# EAGLE schematic Sender Ph1 (EAGLE 9.6.2)

## Sheet 1 of 6: Processor & Base Design
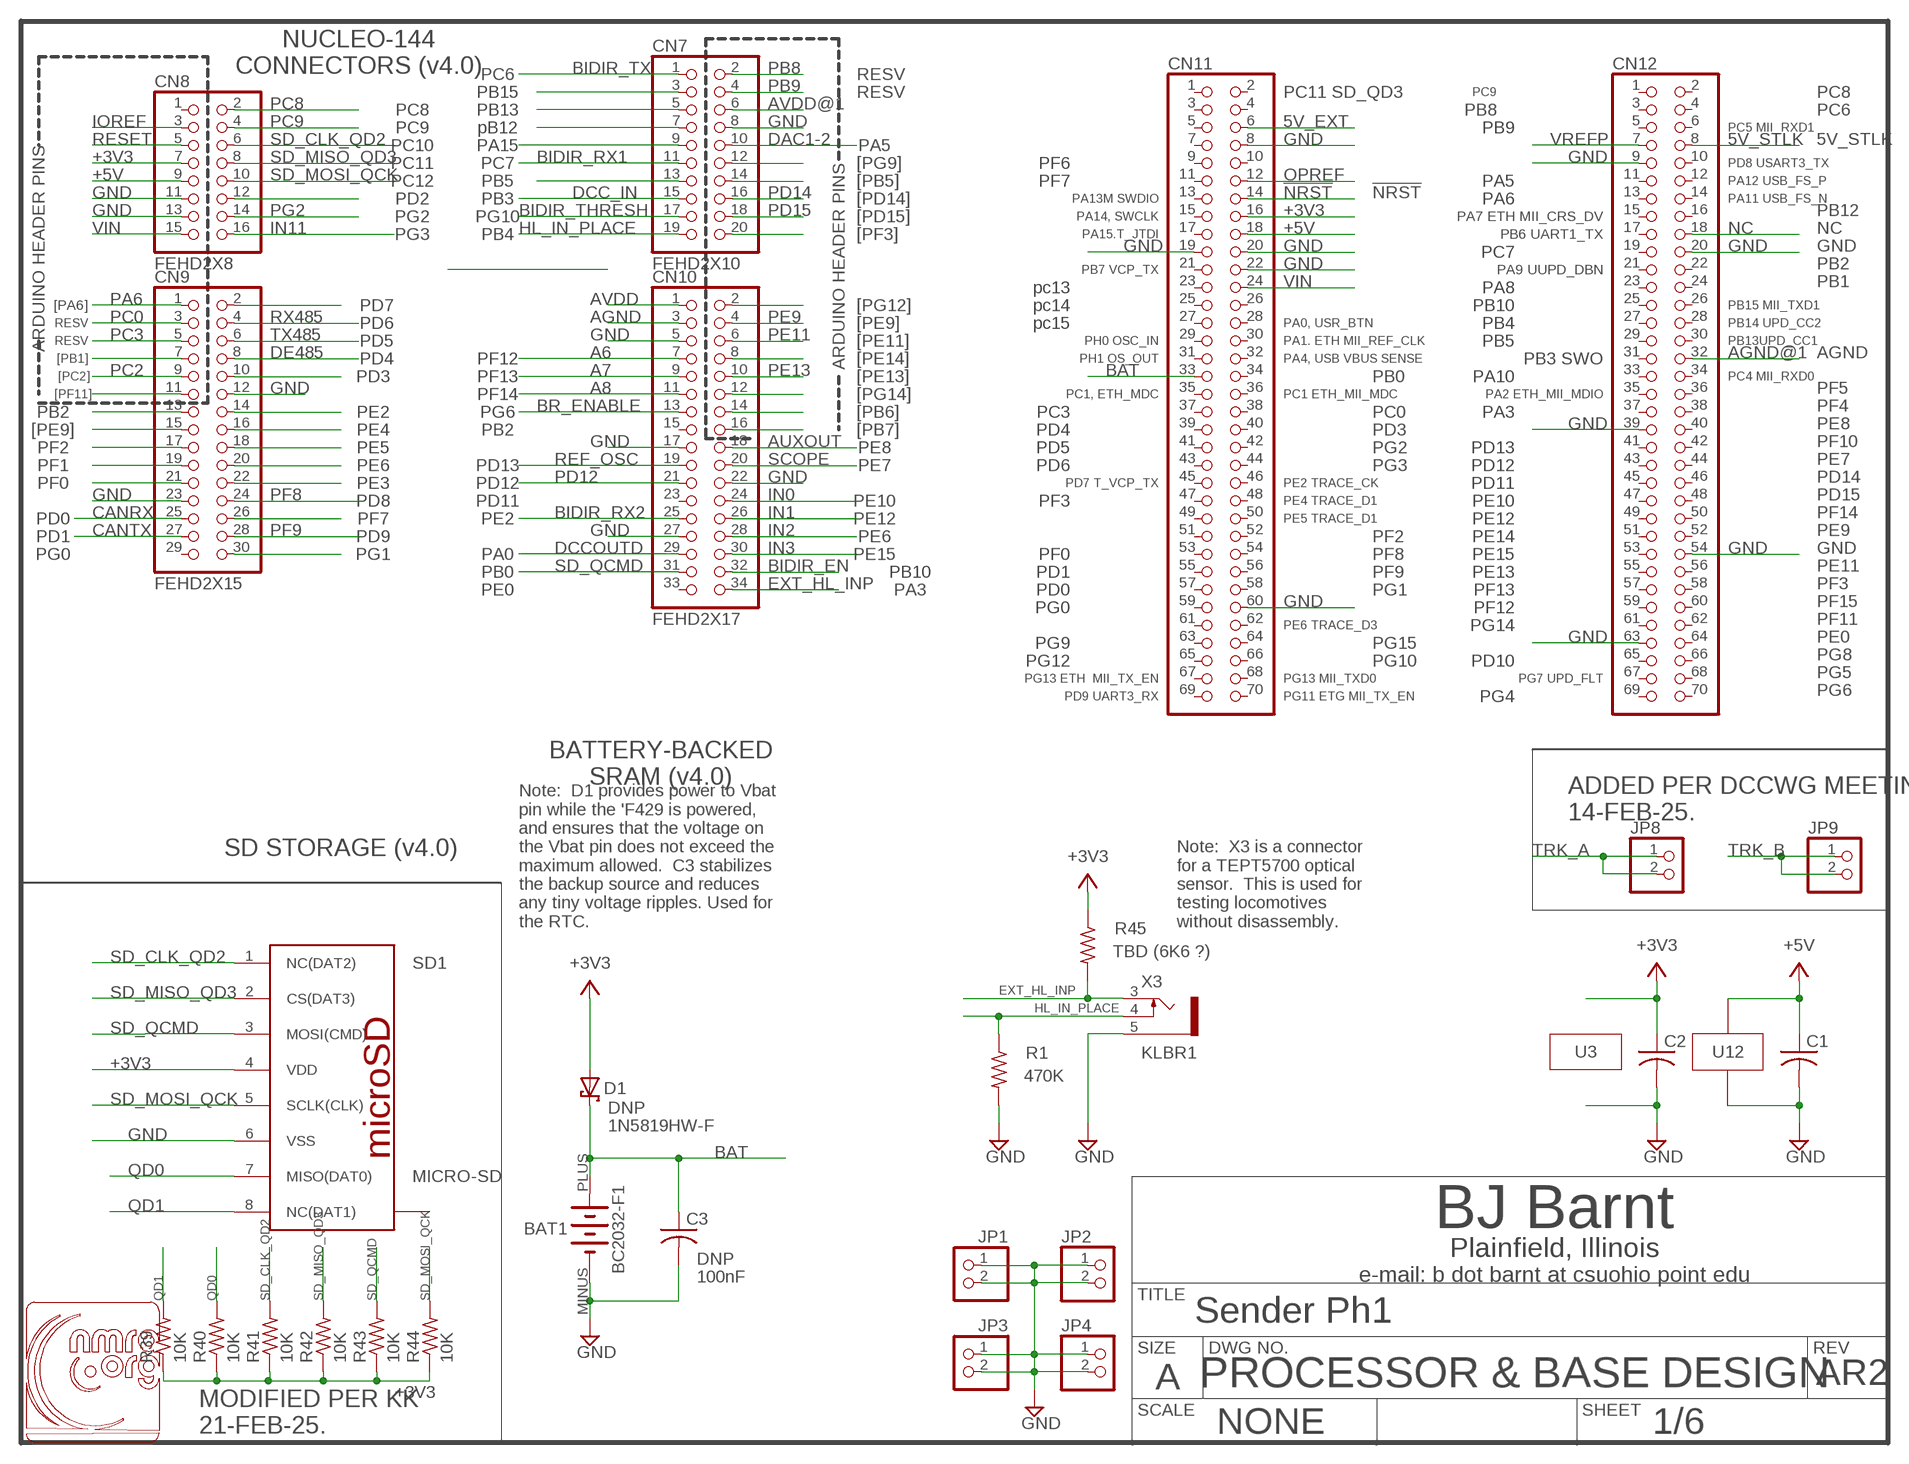
[diagram p0: schematic, sheet 1]
BORDER1 (ANSI_A_SHT2): SPICEPREFIX: X

### Parts
BAT1  BC2032-F1  [BC2032-F1]
C1  C-USC0805  [C0805]
C2  C-USC0805  [C0805]
C3  DNP  C-USC0805  [C0805]
CN7  FEHD2X10  [FE-10X2]
CN8  FEHD2X8  [FE-08X2]
CN9  FEHD2X15  [FE-15X2]
CN10  FEHD2X17  [FE-17X2]
CN11  PINHD-2X35  [2X35]
CN12  PINHD-2X35  [2X35]
D1  DNP  1N5819HW-F  [SOD123]
JP1  PINHD-1X2  [1X02]
JP2  PINHD-1X2  [1X02]
JP3  PINHD-1X2  [1X02]
JP4  PINHD-1X2  [1X02]
JP8  PINHD-1X2  [1X02]
JP9  PINHD-1X2  [1X02]
R1  470K  R-US_R0805  [R0805]
R39  10K  R-US_R0805  [R0805]
R40  10K  R-US_R0805  [R0805]
R41  10K  R-US_R0805  [R0805]
R42  10K  R-US_R0805  [R0805]
R43  10K  R-US_R0805  [R0805]
R44  10K  R-US_R0805  [R0805]
R45  TBD (6K6 ?)  R-US_R0805  [R0805]
SD1  MICRO-SD  [HINGED-SD]
U12  AM26LV31D  AM26C31CD  [SO16]
U$2  NMRA_LOGO-SMALL  [NMRA_LOGO_SM]
X3  KLBR1  [KLBR1]

### Nets
5V_EXT: CN11.6
5V_STLK: CN12.8
!NRST: CN11.14
+3V3: C2.1 CN8.7 CN11.16 D1.2(A) R39.1 R40.1 R41.1 R42.1 R43.1 R44.1 R45.1 SD1.4(VDD) ; also sheet 2,3,4,5
+5V: C1.1 CN8.9 CN11.18 U12.16(VCC) ; also sheet 6
A6: CN10.7 ; also sheet 3
A7: CN10.9 ; also sheet 3
A8: CN10.11 ; also sheet 2
AGND: CN10.3
AGND@1: CN12.32
AUXOUT: CN10.18 ; also sheet 6
AVDD: CN10.1
AVDD@1: CN7.6
BAT: BAT1.PLUS(+) C3.1 CN11.33 D1.1(C)
BIDIR_EN: CN10.32 ; also sheet 4
BIDIR_RX1: CN7.11 ; also sheet 5
BIDIR_RX2: CN10.25 ; also sheet 5
BIDIR_THRESH: CN7.17 ; also sheet 5
BIDIR_TX: CN7.1
BR_ENABLE: CN10.13 ; also sheet 4
CANRX: CN9.25 ; also sheet 2
CANTX: CN9.27 ; also sheet 2
DAC1-2: CN7.10
DCC_IN: CN7.15 ; also sheet 4
DCCOUTD: CN10.29 ; also sheet 4,6
DE485: CN9.8 ; also sheet 2
EXT_HL_INP: CN10.34 R45.2 X3.3
GND: BAT1.MINUS(-) C1.2 C2.2 C3.2 CN7.8 CN8.11 CN8.13 CN9.12 CN9.23 CN10.5 CN10.17 CN10.22 CN10.27 CN11.8 CN11.19 CN11.20 CN11.22 CN11.60 CN12.9 CN12.20 CN12.39 CN12.54 CN12.63 JP1.1 JP1.2 JP2.1 JP2.2 JP3.1 JP3.2 JP4.1 JP4.2 R1.2 SD1.6(VSS) U12.8(GND) X3.5 ; also sheet 2,3,4,5,6
HL_IN_PLACE: CN7.19 R1.1 X3.4
IN0: CN10.24 ; also sheet 6
IN1: CN10.26 ; also sheet 6
IN2: CN10.28 ; also sheet 6
IN3: CN10.30 ; also sheet 6
IN11: CN8.16
IOREF: CN8.3
N$3: CN9.7
N$11: CN9.11
N$18: CN9.15
N$19: CN9.13
N$24: CN9.17
N$32: CN9.19
N$33: CN9.21
N$34: CN9.10
N$35: CN9.14
N$36: CN9.16
N$37: CN9.18
N$38: CN9.20
N$39: CN9.22
N$40: CN9.26
N$41: CN9.30
N$42: CN9.2
N$43: CN8.12
N$47: CN7.3
N$48: CN7.5
N$49: CN7.7
N$50: CN7.9
N$51: CN7.13
N$52: CN7.12
N$53: CN7.14
N$54: CN7.20
N$55: CN10.2
N$56: CN10.8
N$57: CN10.12
N$58: CN10.14
N$59: CN10.16
NC: CN12.18
OPREF: CN11.12
PA6: CN9.1
PB8: CN7.2
PB9: CN7.4
PC0: CN9.3
PC2: CN9.9
PC3: CN9.5
PC8: CN8.2
PC9: CN8.4
PD12: CN10.21
PD14: CN7.16
PD15: CN7.18
PE9: CN10.4
PE11: CN10.6
PE13: CN10.10
PF8: CN9.24
PF9: CN9.28
PG2: CN8.14
QD0: R40.2 SD1.7(MISO(DAT0))
QD1: R39.2 SD1.8(NC(DAT1))
REF_OSC: CN10.19 ; also sheet 3
RESET: CN8.5
RX485: CN9.4 ; also sheet 2
SCOPE: CN10.20 ; also sheet 6
SD_CLK_QD2: CN8.6 R41.2 SD1.1(NC(DAT2))
SD_MISO_QD3: CN8.8 R42.2 SD1.2(CS(DAT3))
SD_MOSI_QCK: CN8.10 R44.2 SD1.5(SCLK(CLK))
SD_QCMD: CN10.31 R43.2 SD1.3(MOSI(CMD))
TRK_A: JP8.1 JP8.2 ; also sheet 4,5
TRK_B: JP9.1 JP9.2 ; also sheet 4,5
TX485: CN9.6 ; also sheet 2
VIN: CN8.15 CN11.24
VREFP: CN12.7
Unconnected: CN8.1 CN9.29 CN10.15 CN10.23 CN10.33 CN11.1 CN11.2 CN11.3 CN11.4 CN11.5 CN11.7 CN11.9 CN11.10 CN11.11 CN11.13 CN11.15 CN11.17 CN11.21 CN11.23 CN11.25 CN11.26 CN11.27 CN11.28 CN11.29 CN11.30 CN11.31 CN11.32 CN11.34 CN11.35 CN11.36 CN11.37 CN11.38 CN11.39 CN11.40 CN11.41 CN11.42 CN11.43 CN11.44 CN11.45 CN11.46 CN11.47 CN11.48 CN11.49 CN11.50 CN11.51 CN11.52 CN11.53 CN11.54 CN11.55 CN11.56 CN11.57 CN11.58 CN11.59 CN11.61 CN11.62 CN11.63 CN11.64 CN11.65 CN11.66 CN11.67 CN11.68 CN11.69 CN11.70 CN12.1 CN12.2 CN12.3 CN12.4 CN12.5 CN12.6 CN12.10 CN12.11 CN12.12 CN12.13 CN12.14 CN12.15 CN12.16 CN12.17 CN12.19 CN12.21 CN12.22 CN12.23 CN12.24 CN12.25 CN12.26 CN12.27 CN12.28 CN12.29 CN12.30 CN12.31 CN12.33 CN12.34 CN12.35 CN12.36 CN12.37 CN12.38 CN12.40 CN12.41 CN12.42 CN12.43 CN12.44 CN12.45 CN12.46 CN12.47 CN12.48 CN12.49 CN12.50 CN12.51 CN12.52 CN12.53 CN12.55 CN12.56 CN12.57 CN12.58 CN12.59 CN12.60 CN12.61 CN12.62 CN12.64 CN12.65 CN12.66 CN12.67 CN12.68 CN12.69 CN12.70 SD1.G1 SD1.G2 SD1.G3 SD1.G4

### Notes on the sheet
- XXX
- XXX
- NUCLEO-144
  CONNECTORS (v4.0)
- PC6 | RESV
- PB15 | RESV | PC11 SD_QD3 | PC9 | PC8
- PC8 | PB13 | PB8 | PC6
- PC9 | pB12 | PB9 | PC5 MII_RXD1
- PC10 | PA15 | PA5
- PC11 | PC7 | [PG9] | PF6 | PD8 USART3_TX
- PC12 | PB5 | [PB5] | PF7 | PA5 | PA12 USB_FS_P
- PD2 | XXX | PB3 | [PD14] | PA13M SWDIO | PA6 | PA11 USB_FS_N
- PG2 | PG10 | [PD15] | PA14, SWCLK | PA7 ETH MII_CRS_DV
- PG3 | PB4 | [PF3] | PA15.T_JTDI | PB6 UART1_TX
- ARDUINO HEADER PINS | PC7
- ARDUINO HEADER PINS
- PB7 VCP_TX | PA9 UUPD_DBN
- pc13 | PA8
- [PA6] | PD7 | [PG12] | pc14 | PB10 | PB15 MII_TXD1
- RESV | PD6 | [PE9] | pc15 | PA0, USR_BTN | PB4 | PB14 UPD_CC2
- RESV | PD5 | [PE11] | PH0 OSC_IN | PA1. ETH MII_REF_CLK | PB5 | PB13UPD_CC1
- [PB1] | PD4 | PF12 | [PE14] | PH1 OS_OUT | PA4, USB VBUS SENSE | PB3 SWO
- [PC2] | PD3 | PF13 | [PE13] | PB0 | PA10 | PC4 MII_RXD0
- [PF11] | PF14 | [PG14] | PC1, ETH_MDC | PC1 ETH_MII_MDC | PA2 ETH_MII_MDIO
- PB2 | PE2 | XXX | PG6 | [PB6] | PC3 | PC0 | PA3
- [PE9] | PE4 | PB2 | [PB7] | PD4 | PD3
- PF2 | PE5 | PE8 | PD5 | PG2 | PD13
- PF1 | PE6 | XXX | PD13 | PE7 | PD6 | PG3 | PD12
- PF0 | PE3 | XXX | PD12 | PD7 T_VCP_TX | PE2 TRACE_CK | PD11
- PD8 | PD11 | PE10 | PF3 | PE4 TRACE_D1 | PE10
- PD0 | PF7 | PE2 | PE12 | PE5 TRACE_D1 | PE12
- PD1 | PD9 | PE6 | PF2 | PE14
- PG0 | PG1 | PA0 | PE15 | PF0 | PF8 | PE15
- PB0 | PB10 | PD1 | PF9 | PE13
- XXX | PE0 | PA3 | PD0 | PG1 | PF13
- PG0 | PF12
- PE6 TRACE_D3 | PG14
- PG9 | PG15
- PG12 | PG10 | PD10
- PG13 ETH  MII_TX_EN | PG13 MII_TXD0 | PG7 UPD_FLT
- PD9 UART3_RX | PG11 ETG MII_TX_EN | PG4
- BATTERY-BACKED
  SRAM (v4.0)
- ADDED PER DCCWG MEETING
  14-FEB-25.
- SD STORAGE (v4.0)
- Note:  D1 provides power to Vbat 
  pin while the 'F429 is powered, 
  and ensures that the voltage on 
  the Vbat pin does not exceed the 
  maximum allowed.  C3 stabilizes 
  the backup source and reduces 
  any tiny voltage ripples. Used for
  the RTC.
- Note:  X3 is a connector
  for a TEPT5700 optical 
  sensor.  This is used for
  testing locomotives 
  without disassembly.
- U3 | U12
- 1N5819HW-F
- 100nF
- PROCESSOR & BASE DESIGN | AR2
- MODIFIED PER KK
  21-FEB-25.

## Sheet 2 of 6: LCC & RS-485 Communications
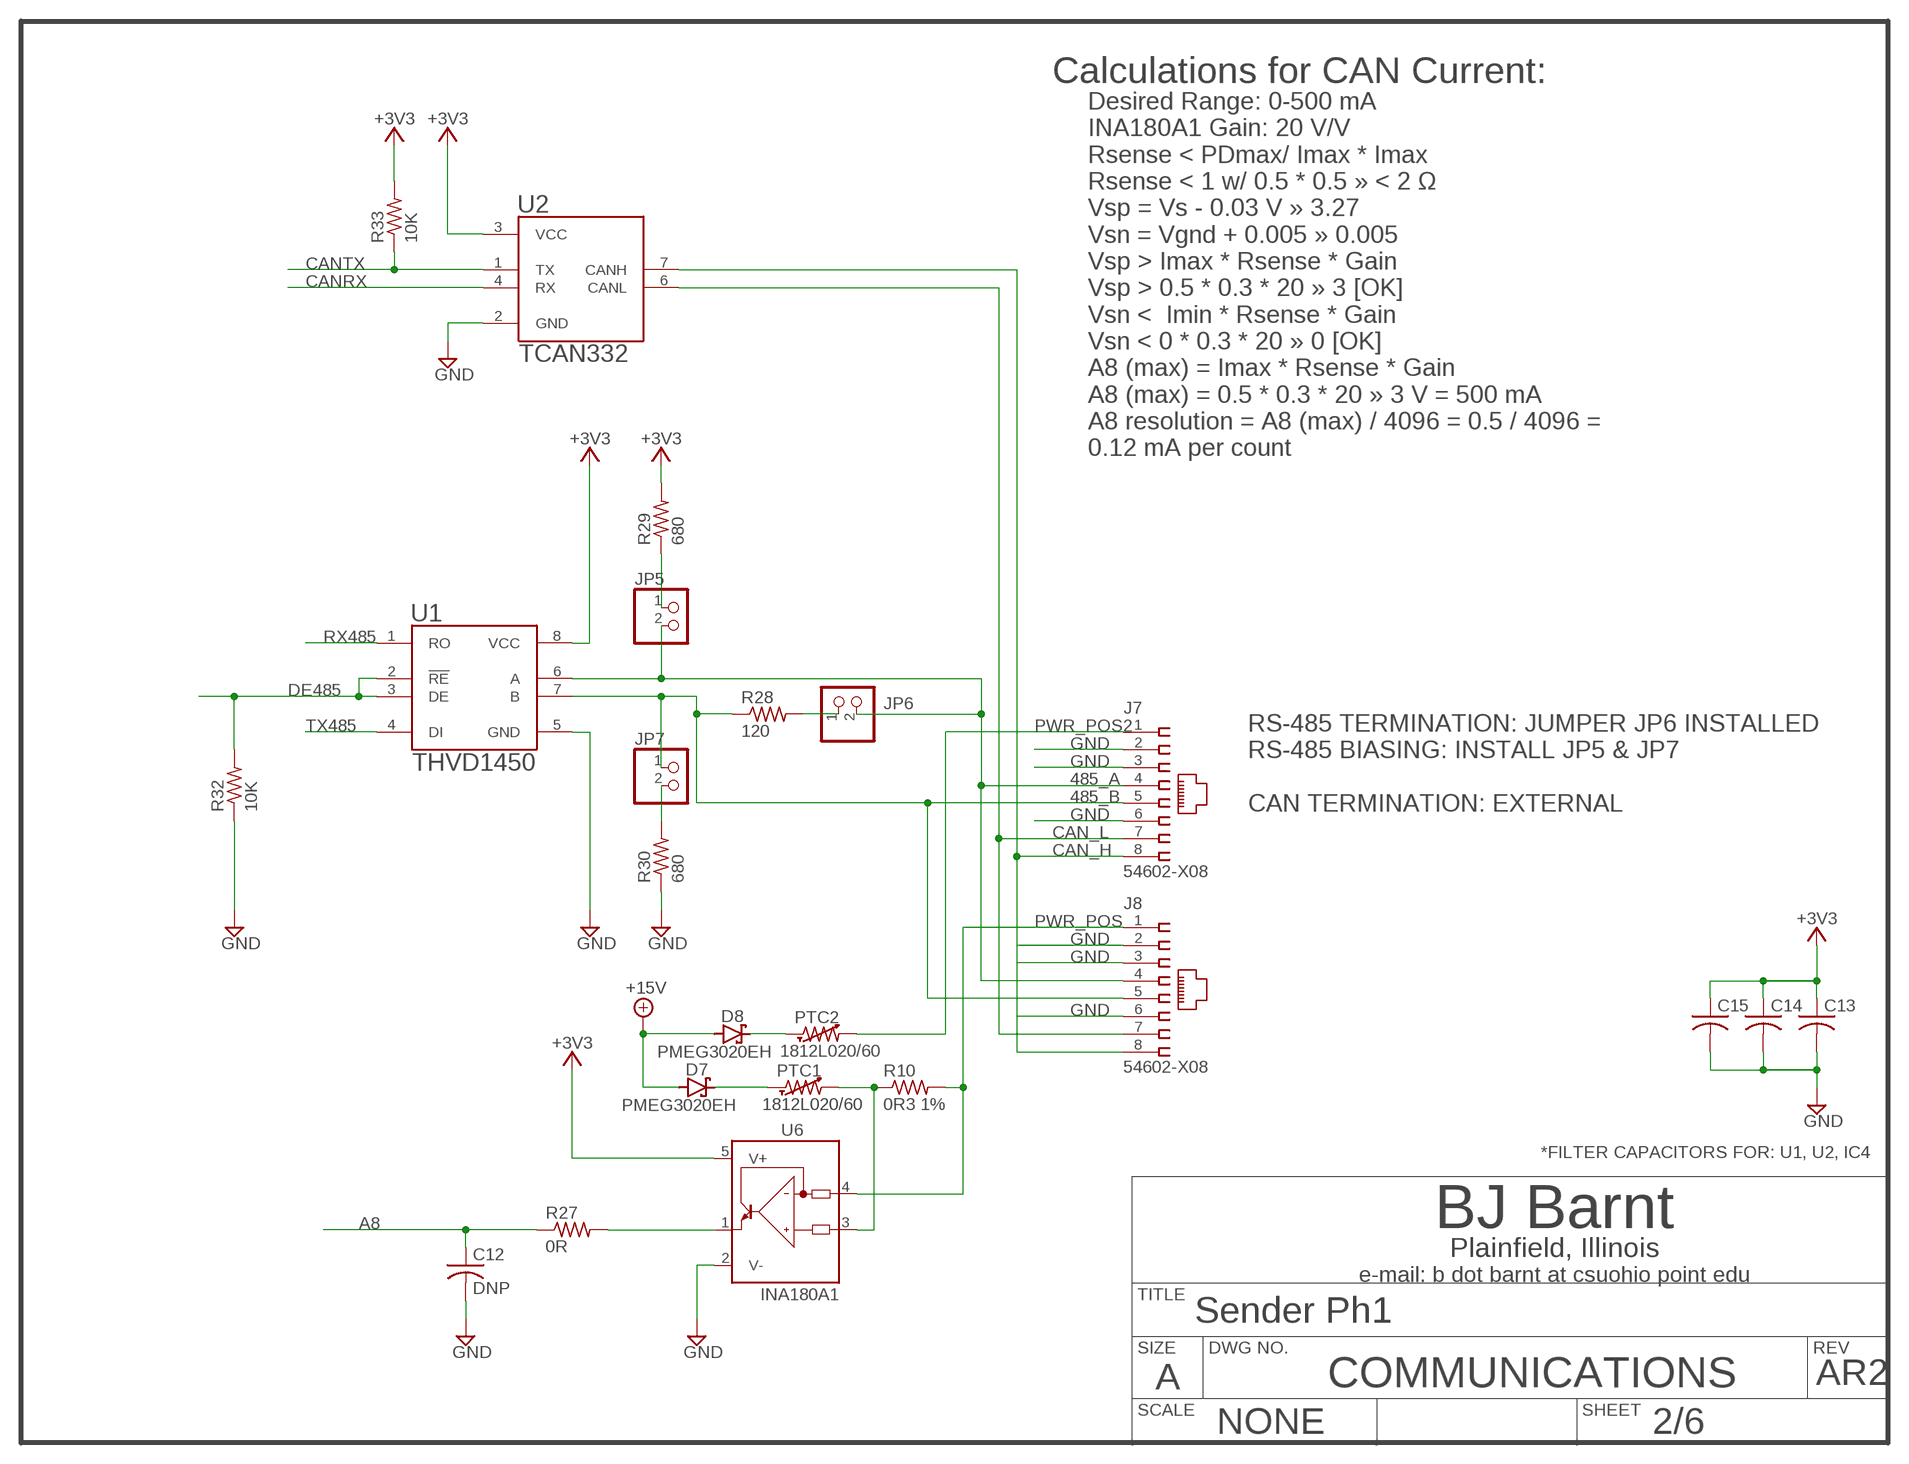
[diagram p1: schematic, sheet 2]
BORDER2 (ANSI_A_SHT2): SPICEPREFIX: X

### Parts
C12  DNP  C-USC0805  [C0805]
C13  C-USC0805  [C0805]
C14  C-USC0805  [C0805]
C15  C-USC0805  [C0805]
D7  PMEG3020EH  [SODFL3718X115]
D8  PMEG3020EH  [SODFL3718X115]
J7  54602-X08  [54602-X08]
J8  54602-X08  [54602-X08]
JP5  PINHD1X2  [FE-01X2]
JP6  PINHD1X2  [FE-01X2]
JP7  PINHD1X2  [FE-01X2]
PTC1  1812L020/60  [1812L]
PTC2  1812L020/60  [1812L]
R10  0R3 1%  R-US_R2512  [R2512]
R27  0R  R-US_R0805  [R0805]
R28  120  R-US_R1206  [R1206]
R29  680  R-US_R1206  [R1206]
R30  680  R-US_R1206  [R1206]
R32  10K  R-US_R0805  [R0805]
R33  10K  R-US_R0805  [R0805]
U1  THVD1450  SN65HVD11D  [SO-08]
U2  TCAN332  SN65HVD232QD  [SO-08]
U6  INA180A1  INA138  [SOT23-5]

### Nets
485_A: J7.4 J8.4 JP5.2 JP6.2 U1.6(A)
485_B: J7.5 J8.5 JP7.1 R28.1 U1.7(B)
+3V3: C13.1 C14.1 C15.1 R29.2 R33.2 U1.8(VCC) U2.3(VCC) U6.5(V+) ; also sheet 1,3,4,5
+15V: D7.2(A) D8.2(A) ; also sheet 3,4,5
A8: C12.1 R27.1 ; also sheet 1
CAN_H: J7.8 J8.8 U2.7(CANH)
CAN_L: J7.7 J8.7 U2.6(CANL)
CANRX: U2.4(RX) ; also sheet 1
CANTX: R33.1 U2.1(TX) ; also sheet 1
DE485: R32.2 U1.2(!RE) U1.3(DE) ; also sheet 1
GND: C12.2 C13.2 C14.2 C15.2 J7.2 J7.3 J7.6 J8.2 J8.3 J8.6 R30.1 R32.1 U1.5(GND) U2.2(GND) U6.2(V-) ; also sheet 1,3,4,5,6
N$4: PTC1.P$2 R10.1 U6.3(IN+)
N$17: R27.2 U6.1(OUT)
N$20: JP5.1 R29.1
N$21: JP7.2 R30.2
N$22: JP6.1 R28.2
N$26: D7.1(C) PTC1.P$1
N$27: D8.1(C) PTC2.P$1
PWR_POS: J8.1 R10.2 U6.4(IN-)
PWR_POS2: J7.1 PTC2.P$2
RX485: U1.1(RO) ; also sheet 1
TX485: U1.4(DI) ; also sheet 1

### Notes on the sheet
- Calculations for CAN Current:
- Desired Range: 0-500 mA
  INA180A1 Gain: 20 V/V
  Rsense < PDmax/ Imax * Imax
  Rsense < 1 w/ 0.5 * 0.5 » < 2 Ω
  Vsp = Vs - 0.03 V » 3.27
  Vsn = Vgnd + 0.005 » 0.005
  Vsp > Imax * Rsense * Gain
  Vsp > 0.5 * 0.3 * 20 » 3 [OK]
  Vsn <  Imin * Rsense * Gain
  Vsn < 0 * 0.3 * 20 » 0 [OK]
  A8 (max) = Imax * Rsense * Gain
  A8 (max) = 0.5 * 0.3 * 20 » 3 V = 500 mA
  A8 resolution = A8 (max) / 4096 = 0.5 / 4096 = 
  0.12 mA per count
- RS-485 TERMINATION: JUMPER JP6 INSTALLED
  RS-485 BIASING: INSTALL JP5 & JP7
  
  CAN TERMINATION: EXTERNAL
- *FILTER CAPACITORS FOR: U1, U2, IC4
- COMMUNICATIONS | AR2

## Sheet 3 of 6: Self-Test ardware
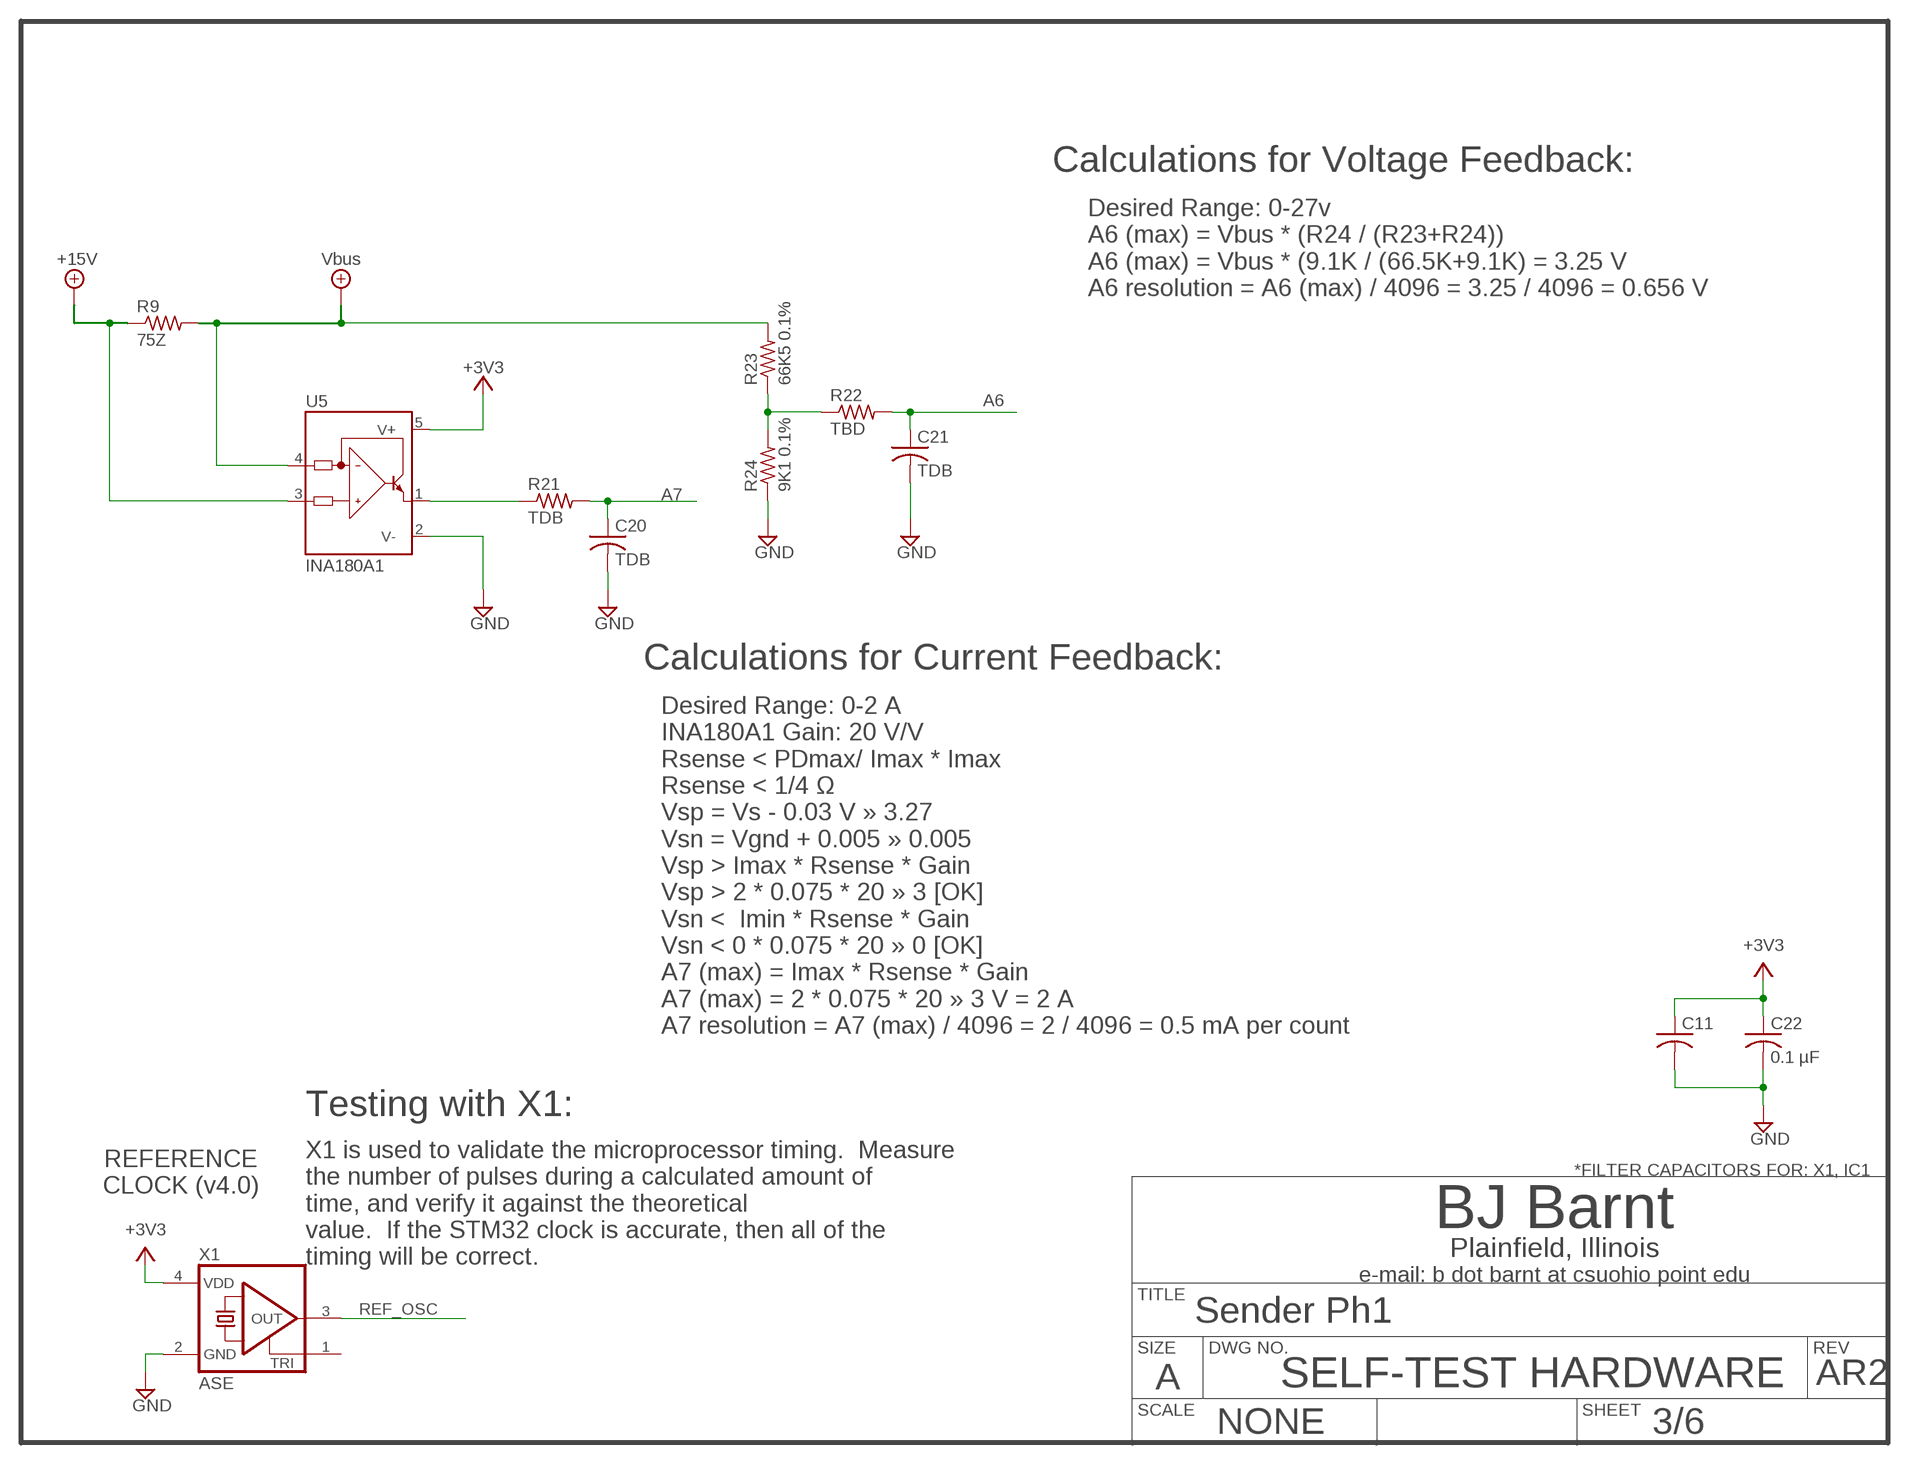
[diagram p2: schematic, sheet 3]
BORDER4 (ANSI_A_SHT2): SPICEPREFIX: X

### Parts
C11  C-USC0805  [C0805]
C20  TDB  C-USC0805  [C0805]
C21  TDB  C-USC0805  [C0805]
C22  0.1 µF  C-USC0805  [C0805]
R9  75Z  R-US_R5025  [R5025]
R21  TDB  R-US_R0805  [R0805]
R22  TBD  R-US_R0805  [R0805]
R23  66K5 0.1%  R-US_R0805  [R0805]
R24  9K1 0.1%  R-US_R0805  [R0805]
U5  INA180A1  INA138  [SOT23-5]
X1  ASE  [ASE]

### Nets
+3V3: C11.1 C22.1 U5.5(V+) X1.4(VDD) ; also sheet 1,2,4,5
+15V: R9.1 U5.3(IN+) ; also sheet 2,4,5
A6: C21.1 R22.2 ; also sheet 1
A7: C20.1 R21.2 ; also sheet 1
GND: C11.2 C20.2 C21.2 C22.2 R24.1 U5.2(V-) X1.2(GND) ; also sheet 1,2,4,5,6
N$12: R21.1 U5.1(OUT)
N$15: R22.1 R23.1 R24.2
REF_OSC: X1.3(OUT) ; also sheet 1
VBUS: R9.2 R23.2 U5.4(IN-) ; supply symbol labelled Vbus ; also sheet 4
Unconnected: X1.1(TRI)

### Notes on the sheet
- Calculations for Voltage Feedback:
- Desired Range: 0-27v
  A6 (max) = Vbus * (R24 / (R23+R24))
  A6 (max) = Vbus * (9.1K / (66.5K+9.1K) = 3.25 V
  A6 resolution = A6 (max) / 4096 = 3.25 / 4096 = 0.656 V
- Calculations for Current Feedback:
- Desired Range: 0-2 A
  INA180A1 Gain: 20 V/V
  Rsense < PDmax/ Imax * Imax
  Rsense < 1/4 Ω
  Vsp = Vs - 0.03 V » 3.27
  Vsn = Vgnd + 0.005 » 0.005
  Vsp > Imax * Rsense * Gain
  Vsp > 2 * 0.075 * 20 » 3 [OK]
  Vsn <  Imin * Rsense * Gain
  Vsn < 0 * 0.075 * 20 » 0 [OK]
  A7 (max) = Imax * Rsense * Gain
  A7 (max) = 2 * 0.075 * 20 » 3 V = 2 A
  A7 resolution = A7 (max) / 4096 = 2 / 4096 = 0.5 mA per count
- Testing with X1:
- X1 is used to validate the microprocessor timing.  Measure 
  the number of pulses during a calculated amount of 
  time, and verify it against the theoretical
  value.  If the STM32 clock is accurate, then all of the 
  timing will be correct.
- *FILTER CAPACITORS FOR: X1, IC1
- REFERENCE
  CLOCK (v4.0)
- SELF-TEST HARDWARE | AR2

## Sheet 4 of 6: Power & Power Station
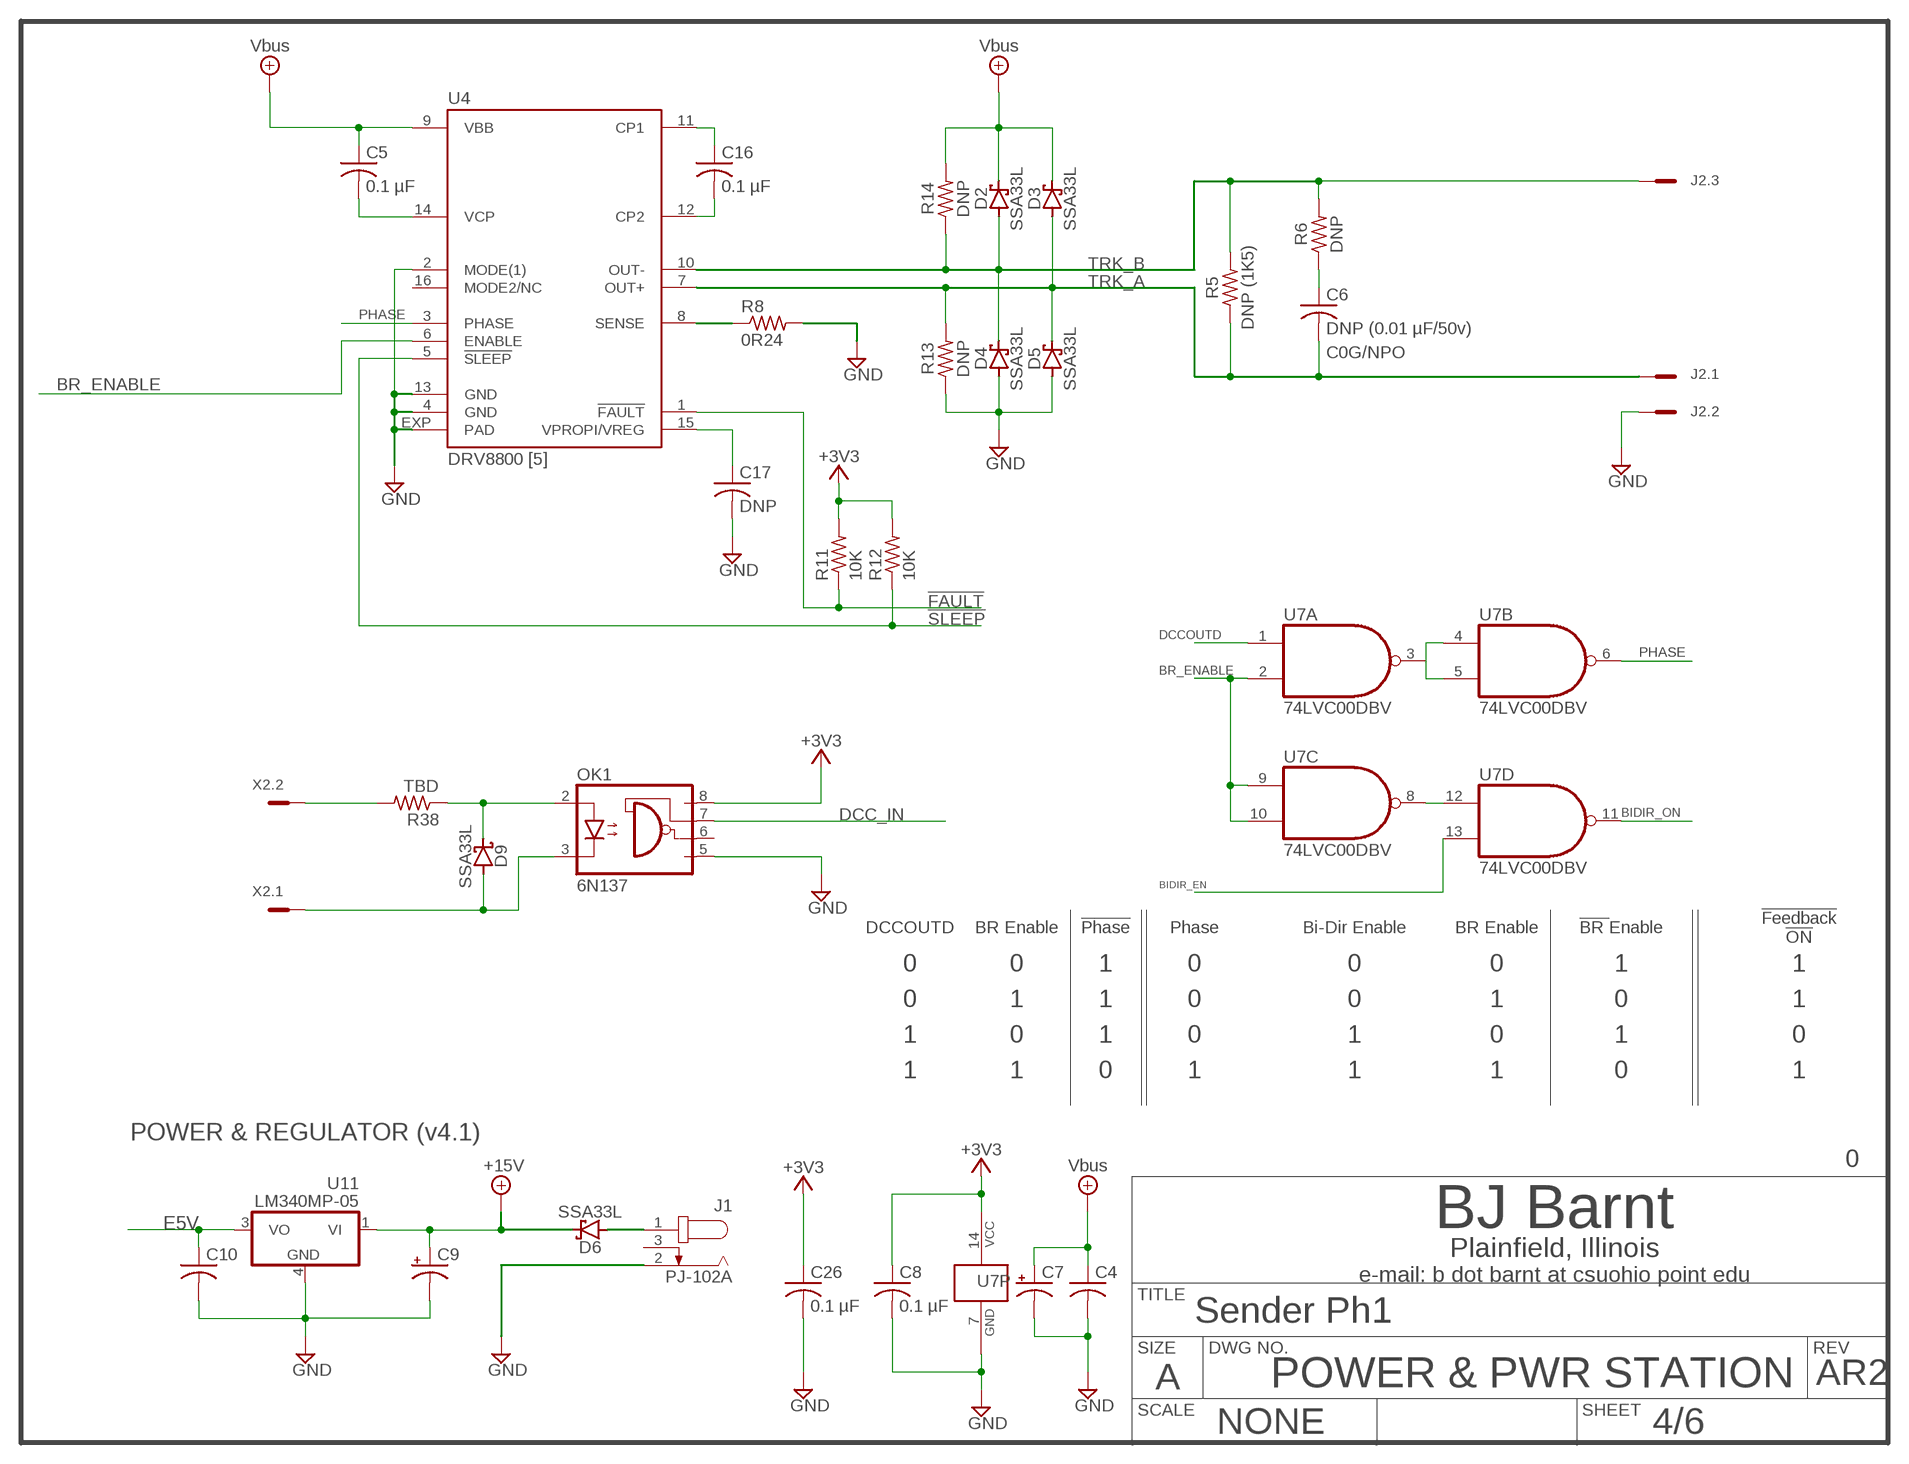
[diagram p3: schematic, sheet 4]
BORDER3 (ANSI_A_SHT2): SPICEPREFIX: X

### Parts
C4  C-USC0603  [C0603]
C5  0.1 µF  C-USC0603  [C0603]
C6  DNP (0.01 µF/50v)  C-USC0805  [C0805]
C7  CPOL-USD  [PANASONIC_D]
C8  0.1 µF  C-USC0805  [C0805]
C9  CPOL-USD  [PANASONIC_D]
C10  C-USC0805  [C0805]
C16  0.1 µF  C-USC0603  [C0603]
C17  DNP  C-USC0603  [C0603]
C26  0.1 µF  C-USC0805  [C0805]
D2  SSA33L  PMEG3020EH  [SODFL3718X115]
D3  SSA33L  PMEG3020EH  [SODFL3718X115]
D4  SSA33L  PMEG3020EH  [SODFL3718X115]
D5  SSA33L  PMEG3020EH  [SODFL3718X115]
D6  SSA33L  PMEG3020EH  [SODFL3718X115]
D9  SSA33L  PMEG3020EH  [SODFL3718X115]
J1  PJ-102A  [PJ-102A]
J2  MC3  [MC3]
OK1  6N137  [DIL08]
R5  DNP (1K5)  R-US_R1210  [R1210]
R6  DNP  R-US_R0805  [R0805]
R8  0R24  R-US_R2512  [R2512]
R11  10K  R-US_R0805  [R0805]
R12  10K  R-US_R0805  [R0805]
R13  DNP  R-US_R0805  [R0805]
R14  DNP  R-US_R0805  [R0805]
R38  TBD  R-US_R0805  [R0805]
U4  DRV8800 [5]  DRV88005  [HTSSOP16PWP_5MIL]
U7  74LVC00DBV  7400D  [SO14]
U11  LM340MP-05  [SOT223]
X2  MC2  [MC2]

### Nets
!FAULT: R11.1 U4.1(!FAULT)
!PHASE: U7.3(A:O) U7.4(B:I0) U7.5(B:I1)
!SLEEP: R12.1 U4.5(!SLEEP)
+3V3: C8.1 C26.1 OK1.8(VCC) R11.2 R12.2 U7.14(P:VCC) ; also sheet 1,2,3,5
+15V: C9.+ D6.1(C) U11.1(VI) ; also sheet 2,3,5
BIDIR_EN: U7.13(D:I1) ; also sheet 1
BIDIR_ON: U7.11(D:O) ; also sheet 5
BR_ENABLE: U4.6(ENABLE) U7.2(A:I1) U7.9(C:I0) U7.10(C:I1) ; also sheet 1
DCC_IN: OK1.7(VE) ; also sheet 1
DCCOUTD: U7.1(A:I0) ; also sheet 1,6
E5V: C10.1 U11.3(VO)
GND: C4.2 C7.- C8.2 C9.- C10.2 C17.2 C26.2 D4.2(A) D5.2(A) J1.2 J2.2 OK1.5(GND) R8.2 R13.1 U4.2(MODE(1)) U4.4(GND) U4.13(GND) U4.EXP(PAD) U7.7(P:GND) U11.4(GND) ; also sheet 1,2,3,5,6
N$1: C6.1 R6.1
N$7: R8.1 U4.8(SENSE)
N$8: C5.2 U4.14(VCP)
N$9: C16.1 U4.11(CP1)
N$10: C16.2 U4.12(CP2)
N$14: C17.1 U4.15(VPROPI/VREG)
N$25: D6.2(A) J1.1
N$28: R38.2 X2.2
N$29: D9.1(C) OK1.2(A) R38.1
N$30: D9.2(A) OK1.3(C) X2.1
N$31: U7.8(C:O) U7.12(D:I0)
PHASE: U4.3(PHASE) U7.6(B:O)
TRK_A: C6.2 D3.2(A) D5.1(C) J2.1 R5.1 R13.2 U4.7(OUT+) ; also sheet 1,5
TRK_B: D2.2(A) D4.1(C) J2.3 R5.2 R6.2 R14.1 U4.10(OUT-) ; also sheet 1,5
VBUS: C4.1 C5.1 C7.+ D2.1(C) D3.1(C) R14.2 U4.9(VBB) ; supply symbol labelled Vbus ; also sheet 3
Unconnected: J1.3 OK1.6(VO) U4.16(MODE2/NC)

### Notes on the sheet
- DCCOUTD | BR Enable | !Phase | Phase | Bi-Dir Enable | BR Enable | !BR !Enable
- !Feedback
  !ON
- 0 | 0 | 1 | 0 | 0 | 0 | 1 | 1
- 0 | 1 | 1 | 0 | 0 | 1 | 0 | 1
- 1 | 0 | 1 | 0 | 1 | 0 | 1 | 0
- 1 | 1 | 0 | 1 | 1 | 1 | 0 | 1
- POWER & REGULATOR (v4.1)
- 0
- POWER & PWR STATION | AR2

## Sheet 5 of 6: Bidirectional Detection
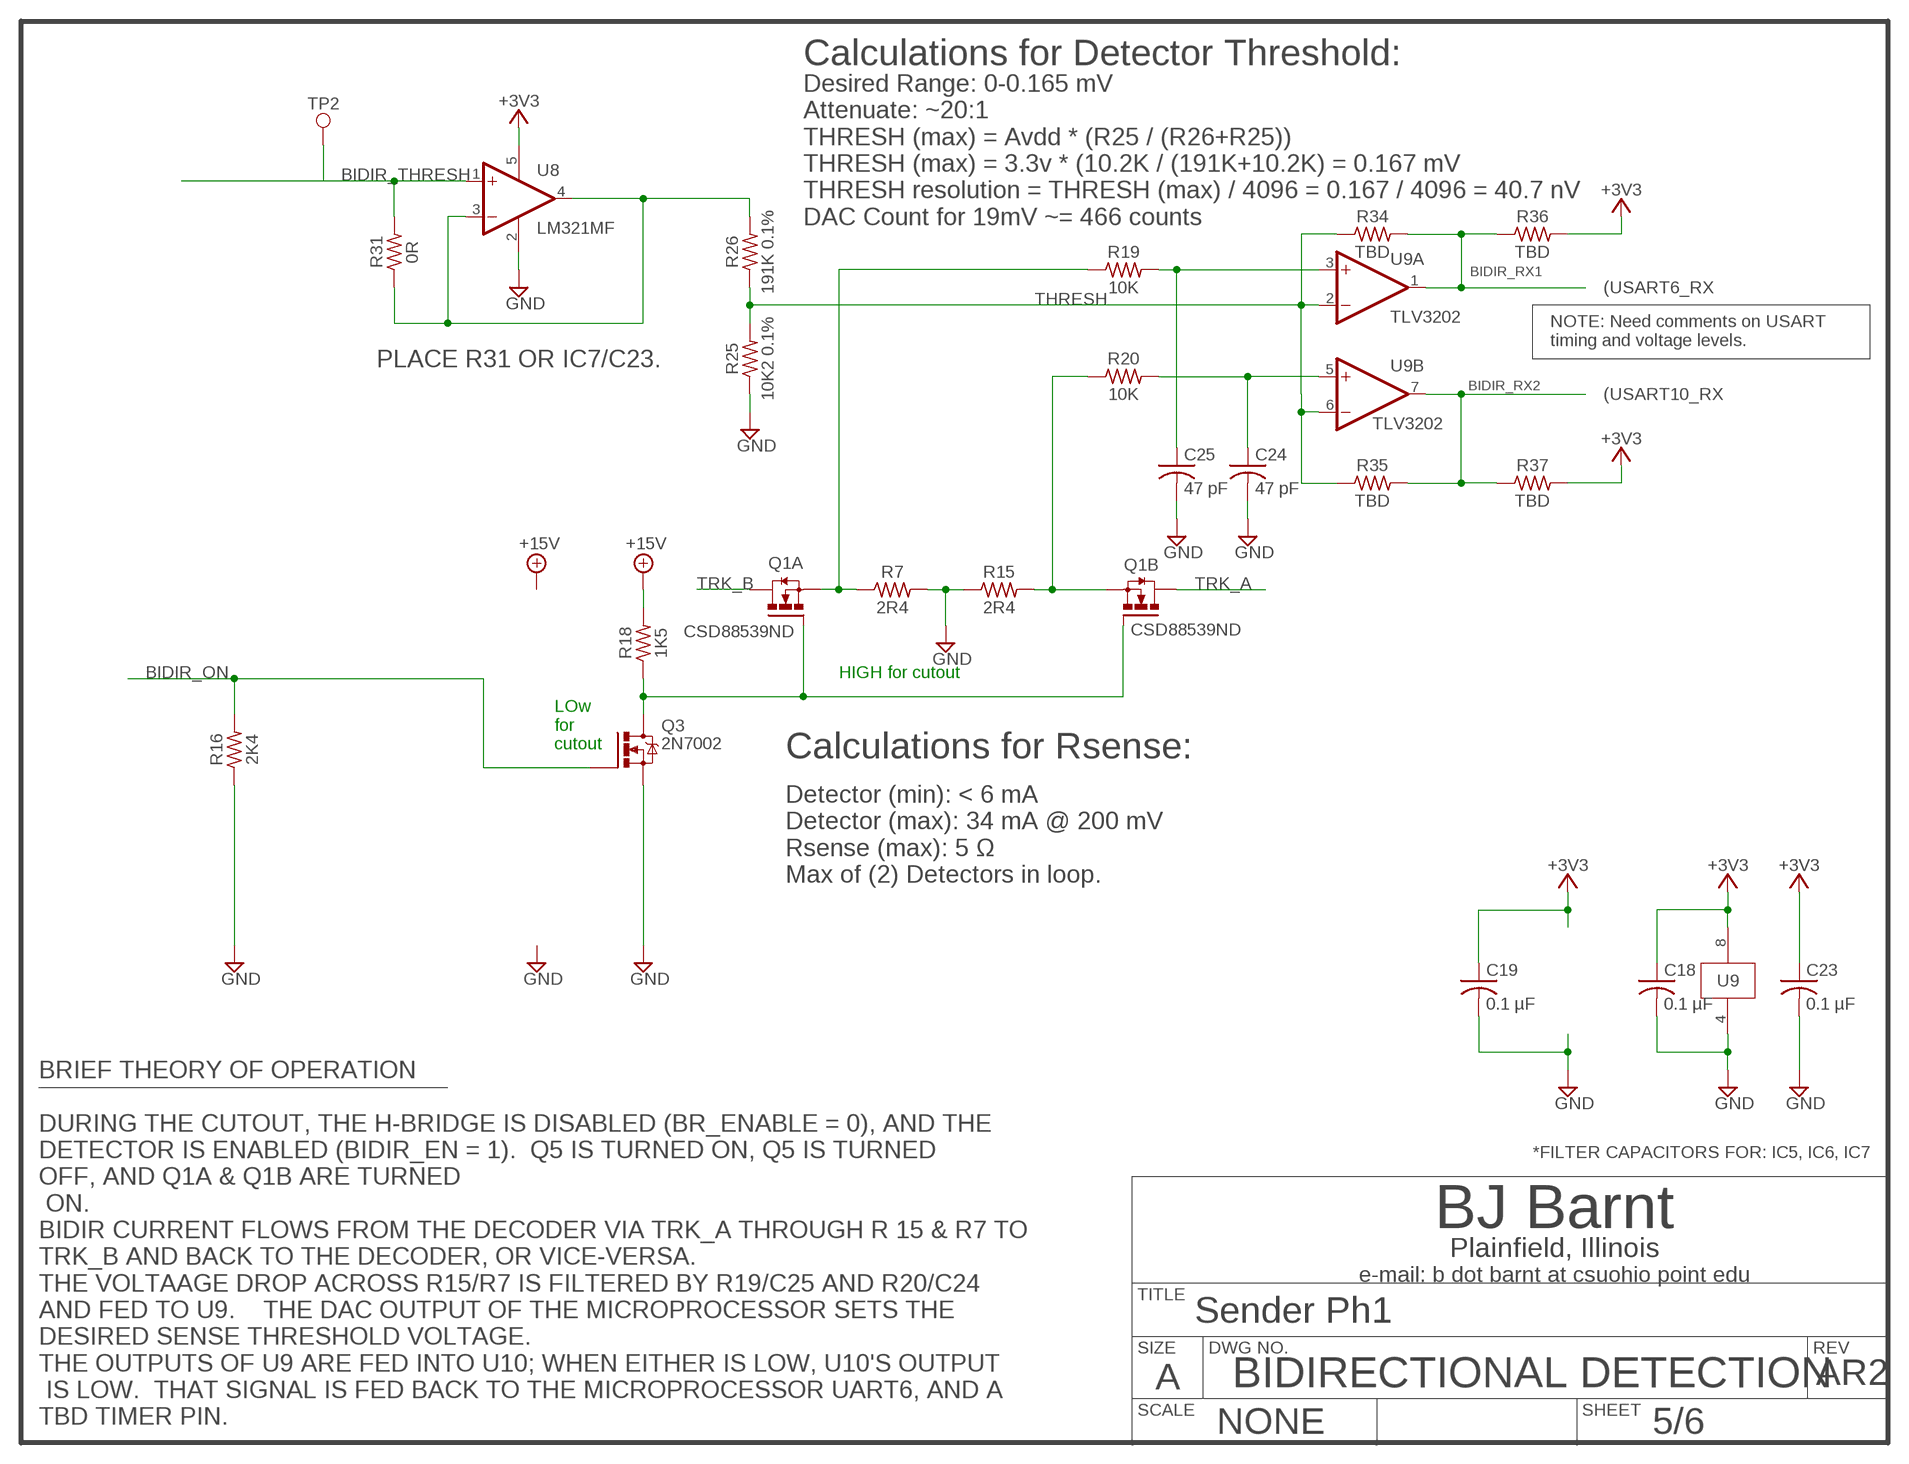
[diagram p4: schematic, sheet 5]

### Parts
C18  0.1 µF  C-USC0805  [C0805]
C19  0.1 µF  C-USC0805  [C0805]
C23  0.1 µF  C-USC0805  [C0805]
C24  47 pF  C-USC0805  [C0805]
C25  47 pF  C-USC0805  [C0805]
Q1  CSD88539ND  [SOIC127P600X144-8]
Q3  2N7002  [SOT23]
R7  2R4  R-US_R1210  [R1210]
R15  2R4  R-US_R1210  [R1210]
R16  2K4  R-US_R0805  [R0805]
R18  1K5  R-US_R1206  [R1206]
R19  10K  R-US_R0805  [R0805]
R20  10K  R-US_R0805  [R0805]
R25  10K2 0.1%  R-US_R0805  [R0805]
R26  191K 0.1%  R-US_R0805  [R0805]
R31  0R  R-US_R0805  [R0805]
R34  TBD  R-US_R0805  [R0805]
R35  TBD  R-US_R0805  [R0805]
R36  TBD  R-US_R0805  [R0805]
R37  TBD  R-US_R0805  [R0805]
TP2  5003  [MINIATURE]
U8  LM321MF  [SOT23-5]
U9  TLV3202  TLC393D  [SO08]

### Nets
+3V3: C18.1 C19.1 C23.1 R36.2 R37.2 U8.5(V+) U9.8(P:V+) ; also sheet 1,2,3,4
+15V: R18.2 ; also sheet 2,3,4
BIDIR_ON: Q3.1(G) R16.2 ; also sheet 4
BIDIR_RX1: R34.2 R36.1 U9.1(A:OUT) ; also sheet 1
BIDIR_RX2: R35.2 R37.1 U9.7(B:OUT) ; also sheet 1
BIDIR_THRESH: R31.2 TP2.P U8.1(+IN) ; also sheet 1
GND: C18.2 C19.2 C23.2 C24.2 C25.2 Q3.2(S) R7.2 R15.1 R16.1 R25.1 U8.2(V-) U9.4(P:V-) ; also sheet 1,2,3,4,6
N$2: Q1.1(A:S) R7.1 R19.1
N$5: Q1.3(B:S) R15.2 R20.1
N$6: Q1.2(A:G) Q1.4(B:G) Q3.3(D) R18.1
N$13: C25.1 R19.2 U9.3(A:+IN)
N$16: C24.1 R20.2 U9.5(B:+IN)
N$23: R26.2 R31.1 U8.3(-IN) U8.4(OUT)
THRESH: R25.2 R26.1 R34.1 R35.1 U9.2(A:-IN) U9.6(B:-IN)
TRK_A: Q1.5(B:D) Q1.6(B:D) ; also sheet 1,4
TRK_B: Q1.7(A:D) Q1.8(A:D) ; also sheet 1,4

### Notes on the sheet
- Calculations for Detector Threshold:
- Desired Range: 0-0.165 mV
  Attenuate: ~20:1
  THRESH (max) = Avdd * (R25 / (R26+R25))
  THRESH (max) = 3.3v * (10.2K / (191K+10.2K) = 0.167 mV
  THRESH resolution = THRESH (max) / 4096 = 0.167 / 4096 = 40.7 nV
  DAC Count for 19mV ~= 466 counts
- (USART6_RX
- NOTE: Need comments on USART 
  timing and voltage levels.
- PLACE R31 OR IC7/C23.
- (USART10_RX
- HIGH for cutout
- Calculations for Rsense:
- LOw 
  for 
  cutout
- Detector (min): < 6 mA
  Detector (max): 34 mA @ 200 mV
  Rsense (max): 5 Ω
  Max of (2) Detectors in loop.
- U9
- *FILTER CAPACITORS FOR: IC5, IC6, IC7
- BIDIRECTIONAL DETECTION | AR2
- BRIEF THEORY OF OPERATION
  
  DURING THE CUTOUT, THE H-BRIDGE IS DISABLED (BR_ENABLE = 0), AND THE 
  DETECTOR IS ENABLED (BIDIR_EN = 1).  Q5 IS TURNED ON, Q5 IS TURNED 
  OFF, AND Q1A & Q1B ARE TURNED
   ON.   
  BIDIR CURRENT FLOWS FROM THE DECODER VIA TRK_A THROUGH R 15 & R7 TO 
  TRK_B AND BACK TO THE DECODER, OR VICE-VERSA.
  THE VOLTAAGE DROP ACROSS R15/R7 IS FILTERED BY R19/C25 AND R20/C24 
  AND FED TO U9.    THE DAC OUTPUT OF THE MICROPROCESSOR SETS THE 
  DESIRED SENSE THRESHOLD VOLTAGE.
  THE OUTPUTS OF U9 ARE FED INTO U10; WHEN EITHER IS LOW, U10'S OUTPUT
   IS LOW.  THAT SIGNAL IS FED BACK TO THE MICROPROCESSOR UART6, AND A 
  TBD TIMER PIN.

## Sheet 6 of 6: Control Bus &Feedback
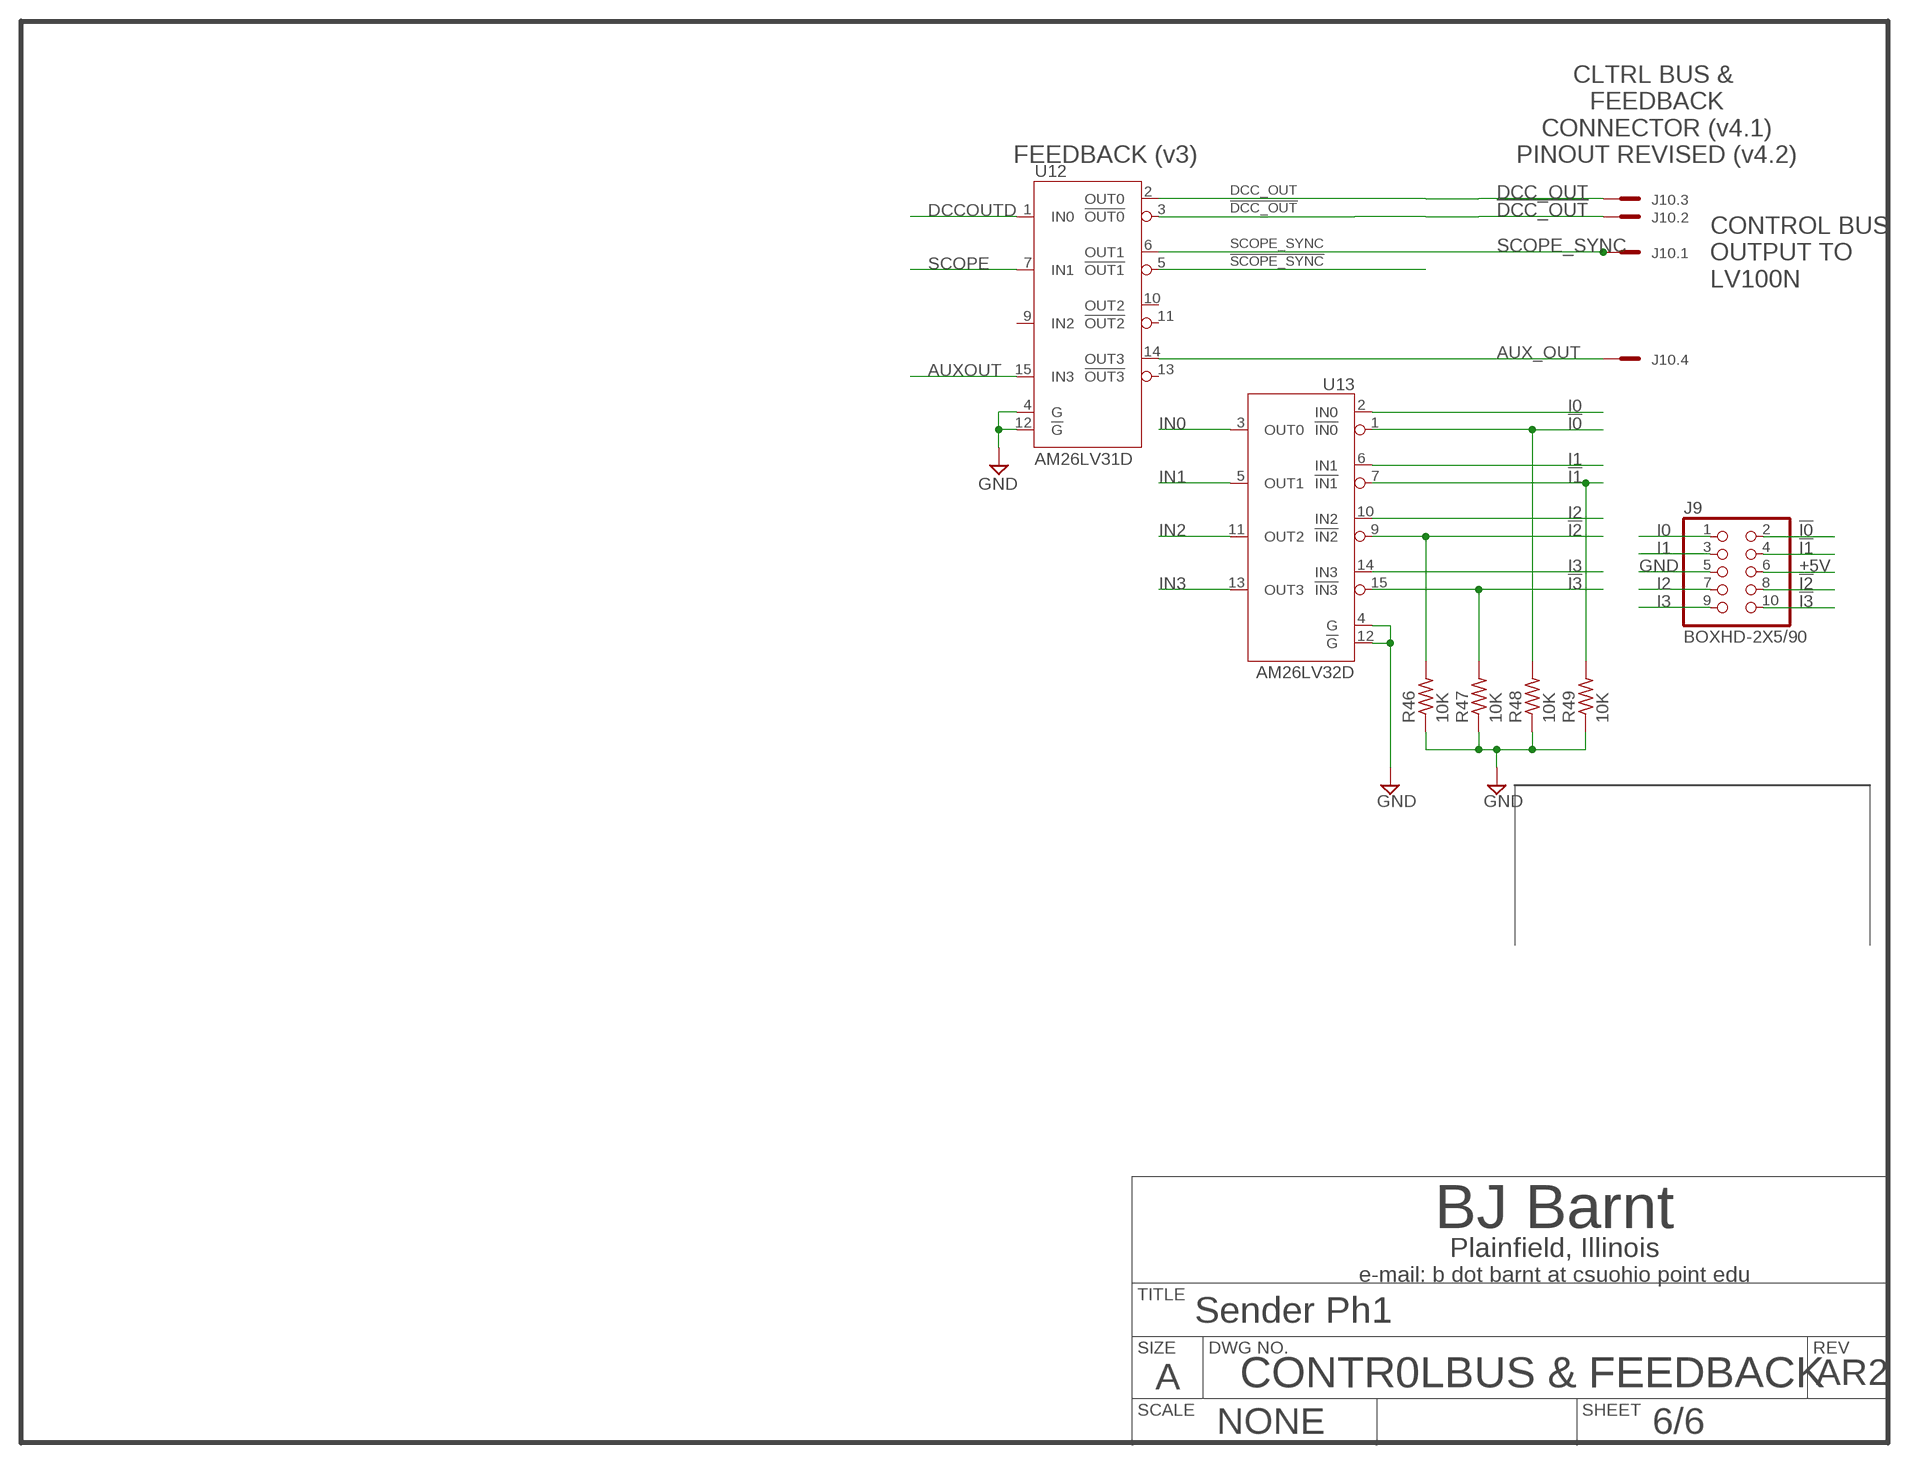
[diagram p5: schematic, sheet 6]
BORDER5 (ANSI_A_SHT2): SPICEPREFIX: X

### Parts
J9  BOXHD-2X5/90  [2X05/90]
J10  MC4  [MC4]
R46  10K  R-US_R0805  [R0805]
R47  10K  R-US_R0805  [R0805]
R48  10K  R-US_R0805  [R0805]
R49  10K  R-US_R0805  [R0805]
U13  AM26LV32D  AM26C32CD  [SO16]

### Nets
!DCC_OUT: J10.2 U12.3(!OUT0)
!I0: J9.2 R48.2 U13.1(!IN0)
!I1: J9.4 R49.2 U13.7(!IN1)
!I2: J9.8 R46.2 U13.9(!IN2)
!I3: J9.10 R47.2 U13.15(!IN3)
!SCOPE_SYNC: U12.5(!OUT1)
+5V: J9.6 ; also sheet 1
AUX_OUT: J10.4 U12.14(OUT3)
AUXOUT: U12.15(IN3) ; also sheet 1
DCC_OUT: J10.3 U12.2(OUT0)
DCCOUTD: U12.1(IN0) ; also sheet 1,4
GND: J9.5 R46.1 R47.1 R48.1 R49.1 U12.4(G) U12.12(!G) U13.4(G) U13.12(!G) ; also sheet 1,2,3,4,5
I0: J9.1 U13.2(IN0)
I1: J9.3 U13.6(IN1)
I2: J9.7 U13.10(IN2)
I3: J9.9 U13.14(IN3)
IN0: U13.3(OUT0) ; also sheet 1
IN1: U13.5(OUT1) ; also sheet 1
IN2: U13.11(OUT2) ; also sheet 1
IN3: U13.13(OUT3) ; also sheet 1
SCOPE: U12.7(IN1) ; also sheet 1
SCOPE_SYNC: J10.1 U12.6(OUT1)
Unconnected: U12.9(IN2) U12.10(OUT2) U12.11(!OUT2) U12.13(!OUT3)

### Notes on the sheet
- FEEDBACK (v3)
- CLTRL BUS & 
  FEEDBACK
  CONNECTOR (v4.1)
  PINOUT REVISED (v4.2)
- CONTROL BUS
  OUTPUT TO 
  LV100N
- CONTR0LBUS & FEEDBACK | AR2

## Power pins joined to a net without a drawn wire
GND: U13.8(GND)
VCC: U13.16(VCC)

## Library data of the parts
BAT1 = MPD Battery Holders:BC2032-F1
C1-C5 C8 C10-C26 = rcl:C-US: CAPACITOR, American symbol; SPICEPREFIX: C
C6 = rcl:C-US: CAPACITOR, American symbol; SPICEPREFIX: C; TYPE: C0G/NPO
C7 C9 = rcl:CPOL-US: POLARIZED CAPACITOR, American symbol; MFG: Panasonic; MF_PN: EEE-1VA101XP; SPICEPREFIX: C
CN7 = con-headers:FEHD2X10
CN8 = con-headers:FEHD2X8
CN9 = con-headers:FEHD2X15
CN10 = con-headers:FEHD2X17
CN11 CN12 = con-headers:PINHD-2X35: PIN HEADER
D1 = Diodes Inc:1N5819HW
D2-D9 = Nexperia Diodes:PMEG3020EH
J1 = con-misc:PJ-102A: 2mm Power Jack with Pins CUI Stack PJ-102A
J2 = con-phoenix-381_MCO@1:MC3: Mini-Combicon 3.81mm horizontal 3-polig (ohne Gegenstecker)
J7 J8 = con-misc:54602-X08: FCI 8-POL SHALLOW LATCH CONNECTOR PCB MOD JACK
J9 = BOXHEAD:BOXHD-2X5: BOX HEADER ON-SHORE TECHNOLOGY 302 SERIES
J10 = con-phoenix-381_MCO@1:MC4: Mini-Combicon 3.81mm horizontal 4-polig (ohne Gegenstecker)
JP1-JP4 = pinhead-rnd:PINHD-1X2
JP5-JP7 = con-headers:PINHD1X2
JP8 JP9 = pinhead:PINHD-1X2: PIN HEADER
OK1 = optocoupler:6N137: MOTOROLA OPTO COUPLER; MPN: 6N137; OC_FARNELL: 6N137; OC_NEWARK: 6N137
PTC1 PTC2 = LIttlefuse PTC:1812L*
Q1 = TI-Power:CSD88539ND; MFG: Panasonic; MFG_PN: ERJ-14BQF2R4U
Q3 = Fairchild:2N7002
R1 R6 R7 R11-R16 R21-R24 R27 R31-R33 R38-R49 = rcl:R-US_: RESISTOR, American symbol; SPICEPREFIX: R
R5 R18 R28-R30 = resistor:R-US_: RESISTOR, American symbol
R8 = resistor:R-US_: RESISTOR, American symbol; MFG: Panasonic; MF_PN: ERJ-1TRQFR24U
R9 = rcl:R-US_: RESISTOR, American symbol; MFG: Panasonic; MF_PN: ERJ-L1DUF75MU; SPICEPREFIX: R
R10 = rcl:R-US_: RESISTOR, American symbol; MFG: Panasonic; MF_PN: ERJ-1TRQFR30U; SPICEPREFIX: R
R19 R20 R25 R26 R34-R37 = rcl@1:R-US_: RESISTOR, American symbol; SPICEPREFIX: R
SD1 = con-molex-SD:MICRO-SD
TP2 = Keystone:500: Keystone Test Point, Miniature 5000 Red 5001 Black 5002 White 5003 Orange 5004 Yellow
U1 = texas-inst:SN65HVD11D
U2 = texas-inst:SN65HVD232QD
U4 = TI-Power:DRV880*: DRV8800 and DRV8801 DC Motor Driver.
U5 U6 = burr-brown:INA138: High-Side Measurement Current Shunt Monitor; MF: TEXAS INSTRUMENTS; MPN: INA138NA/250; OC_FARNELL: 1564888; OC_NEWARK: 80K5906
U7 = 74xx-us:74*00: Quad 2-input NAND gate
U8 = linear:LM321?*: Low Power Single Op Amp Source: http://cache.national.com/ds/LM/LM321.pdf
U9 = linear:TLC393: COMPARATOR
U11 = linear:LM340?-*: Positive VOLTAGE REGULATOR Source: http://cache.national.com/ds/LM/LM340.pdf
U12 = Project Lib:AM26C31C
U13 = Project Lib:AM26C32C
U$2 = LCC_Logo:NMRA_LOGO
X1 = crystal:ASE: 3.3Vdc CMOS SMD CRYSTAL CLOCK OSCILLATOR SOurce: www.abracon.com; OC_FARNELL: unknown; OC_NEWARK: unknown
X2 = con-phoenix-381_MCO:MC2: Mini-Combicon 3.81mm horizontal 2-polig (ohne Gegenstecker)
X3 = con-lumberg:KLBR?: Jack connectors according to JISC 6560, 2.5mm / 3.5 mm Klinkensteckverbinder nach JISC 6560, 2.5mm / 3,5 mm Source: http://www.lumberg.com/Produkte/PDFs/KLBR2.pdf www.lumberg.com/Produkte/PDFs/KLBR1.pdf; MPN: KLBR 1; OC_FARNELL: 1200140; OC_NEWARK: 97K2707

## Net classes
1 Diff pair: width 0.254 mm, drill 0.381 mm, clearance 0.254 mm